# Altium project -STM32-Ethernet-IO-Gateway.PrjPcb
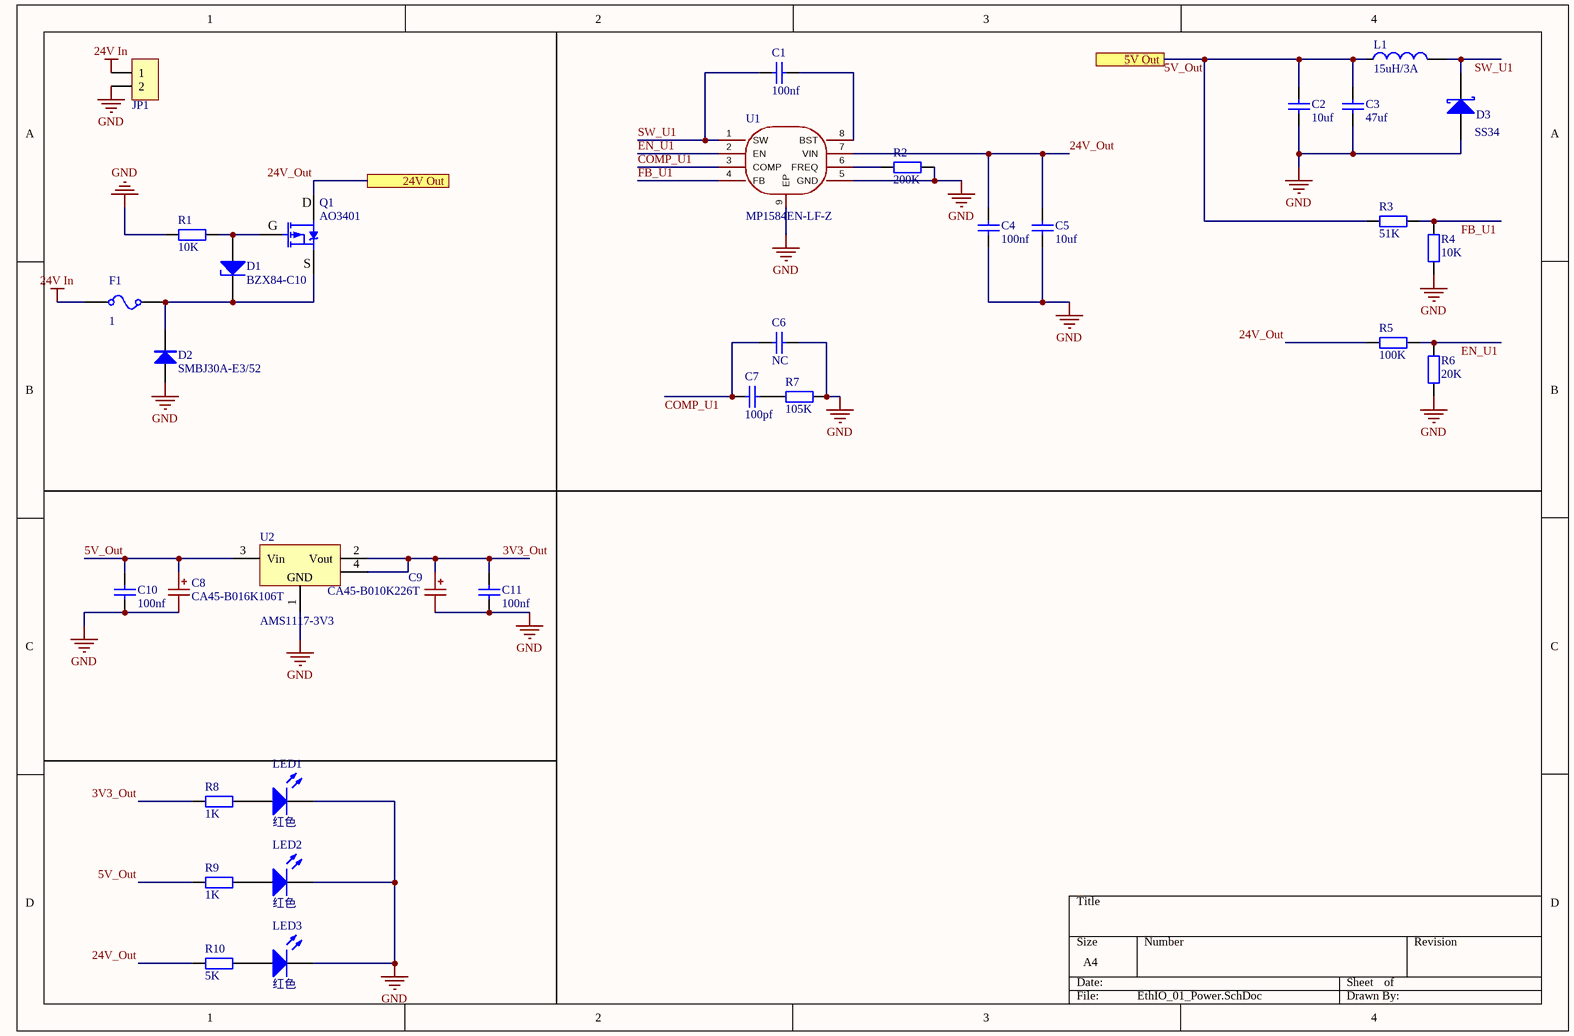
[diagram p0: EthIO_01_Power.SchDoc]
2 sheets, 33 parts. Net scope: flat (ports and power ports of the same name join across sheets).
Board file: EthIO_Gateway.PcbDoc
Sheets:
  EthIO_01_Power.SchDoc
  EthIO_02.SchDoc

## Sheet EthIO_01_Power.SchDoc
size A4; SheetNumber: 1; SheetTotal: 1

### Parts
C1  100nf  [C0805_L]
C2  10uf  [C0805_L]
C3  47uf  [C0805_L]
C4  100nf  [C0805_L]
C5  10uf  [C0805_L]
C6  NC  [C0805_L]
C7  100pf  [C0805_L]
C8  CA45-B016K106T  [CA45-B016K106T]
C9  CA45-B010K226T  [CA45-B016K106T]
C10  100nf  [C0805_L]
C11  100nf  [C0805_L]
D1  BZX84-C10  [SOD-123]
D2  SMBJ30A-E3/52  [SMB]
D3  SS34  [SMA]
F1  CURRENT: 1  (hidden comment: Fuse)
JP1  HDR-1X2  [KF128-3.81-2P]  (value not drawn)
L1  15uH/3A  [L0805]
LED1  红色  [LED0805_G]
LED2  红色  [LED0805_G]
LED3  红色  [LED0805_G]
Q1  AO3401  [SOT23-3N]
R1  10K  [R0805_L]
R2  200K  [R0805_L]
R3  51K  [R0805_L]
R4  10K  [R0805_L]
R5  100K  [R0805_L]
R6  20K  [R0805_L]
R7  105K  [R0805_L]
R8  1K  [R0805_L]
R9  1K  [R0805_L]
R10  5K  [R0805_L]
U1  MP1584EN-LF-Z  [MP1584EN-LF-Z]
U2  AMS1117-3V3  [SOT223_L]

### Ports
5V Out, 24V Out

### Nets
24V In: F1.2 JP1.1
GND: C2.1 C3.1 C4.1 C5.1 C6.1 C8.2 C9.2 C10.1 C11.1 D2.1(A) D3.1(A) JP1.2 LED1.2(K) LED2.2(K) LED3.2(K) R1.1 R2.2 R4.1 R6.2 R7.1 U1.5(GND) U1.9(EP) U2.1(GND)
3V3_Out: C9.1 C11.2 R8.1 U2.2(Vout) U2.4(GND)
5V_Out: C2.2 C3.2 C8.1 C10.2 L1.1 R3.1 R9.1 U2.3(Vin) ; port 5V Out
24V_Out: C4.2 C5.2 Q1.3(D) R5.1 R10.1 U1.7(VIN) ; port 24V Out
COMP_U1: C6.2 C7.2 U1.3(COMP)
EN_U1: R5.2 R6.1 U1.2(EN)
FB_U1: R3.2 R4.2 U1.4(FB)
SW_U1: C1.2 D3.2(K) L1.2 U1.1(SW)
NetC1_1: C1.1 U1.8(BST)
NetC7_1: C7.1 R7.2
NetD1_1: D1.1(A) Q1.1(G) R1.2
NetD1_2: D1.2(K) D2.2(K) F1.1 Q1.2(S)
NetLED1_1: LED1.1(A) R8.2
NetLED2_1: LED2.1(A) R9.2
NetLED3_1: LED3.1(A) R10.2
NetR2_1: R2.1 U1.6(FREQ)

### Library data of the parts
C1-C7 C10 C11 = C: 贴片电容/MLCC电容; BOM名称: 无极性贴片电容; 当前库版本V2022.12.25 @淘宝卖家:黄晶宝石: 最新版本发布https://shop463601444.taobao.com
C9 = CA45-B016K106T
D1 = 稳压二极管: Zener Diode; 当前库版本V2022.12.25 @淘宝卖家:黄晶宝石: 最新版本发布https://shop463601444.taobao.com
D2 = SMBJ30A-E3/52: 30V 600W瞬态抑制二极管; BOM名称: TVS瞬态抑制二极管; 当前库版本V2022.12.25 @淘宝卖家:黄晶宝石: 最新版本发布https://shop463601444.taobao.com; 属性: 30V 600W
D3 = D-Schottky: 肖特基二极管; 当前库版本V2022.12.25 @淘宝卖家:黄晶宝石: 最新版本发布https://shop463601444.taobao.com
F1 = Fuse: RESISTANCE: 1m; SimulationGenericComponent: True
JP1 = Header 2: 2P接插件; 当前库版本V2022.10.7 @淘宝卖家:黄晶宝石: 最新版本发布https://shop463601444.taobao.com; BOM名称: 2P接插件
L1 = L: 贴片小功率电感; BOM名称: 小功率贴片电感; 联系下单店铺卖家 免费帮你查找封装: 联系下单店铺卖家 免费技术支持
LED1-LED3 = LED: 贴片LED; 封装库来自淘宝卖家：黄晶宝石: 其他店铺购入均为盗版封装库，无更新权益，请立即申请退款，本店现金奖励200~1000元; BOM名称: 贴片LED
Q1 = AO3401: P沟道 30V/4.2A; BOM名称: 场效应管; 联系下单店铺卖家 免费帮你查找封装: 联系下单店铺卖家 免费技术支持; 参数: P沟道 30V/4.2A
R1-R10 = R: 贴片电阻; 联系下单店铺卖家 免费帮你查找封装: 联系下单店铺卖家 免费技术支持; BOM名称: 贴片电阻
U2 = AMS1117: 三端稳压芯片; BOM名称: 稳压芯片; 当前库版本V2022.12.25 @淘宝卖家:黄晶宝石: 最新版本发布https://shop463601444.taobao.com

## Sheet EthIO_02.SchDoc
size A4; SheetNumber: 2; SheetTotal: 2